# Altium schematic sheet Main.SchDoc
size A4; SheetNumber: 1; SheetTotal: 1
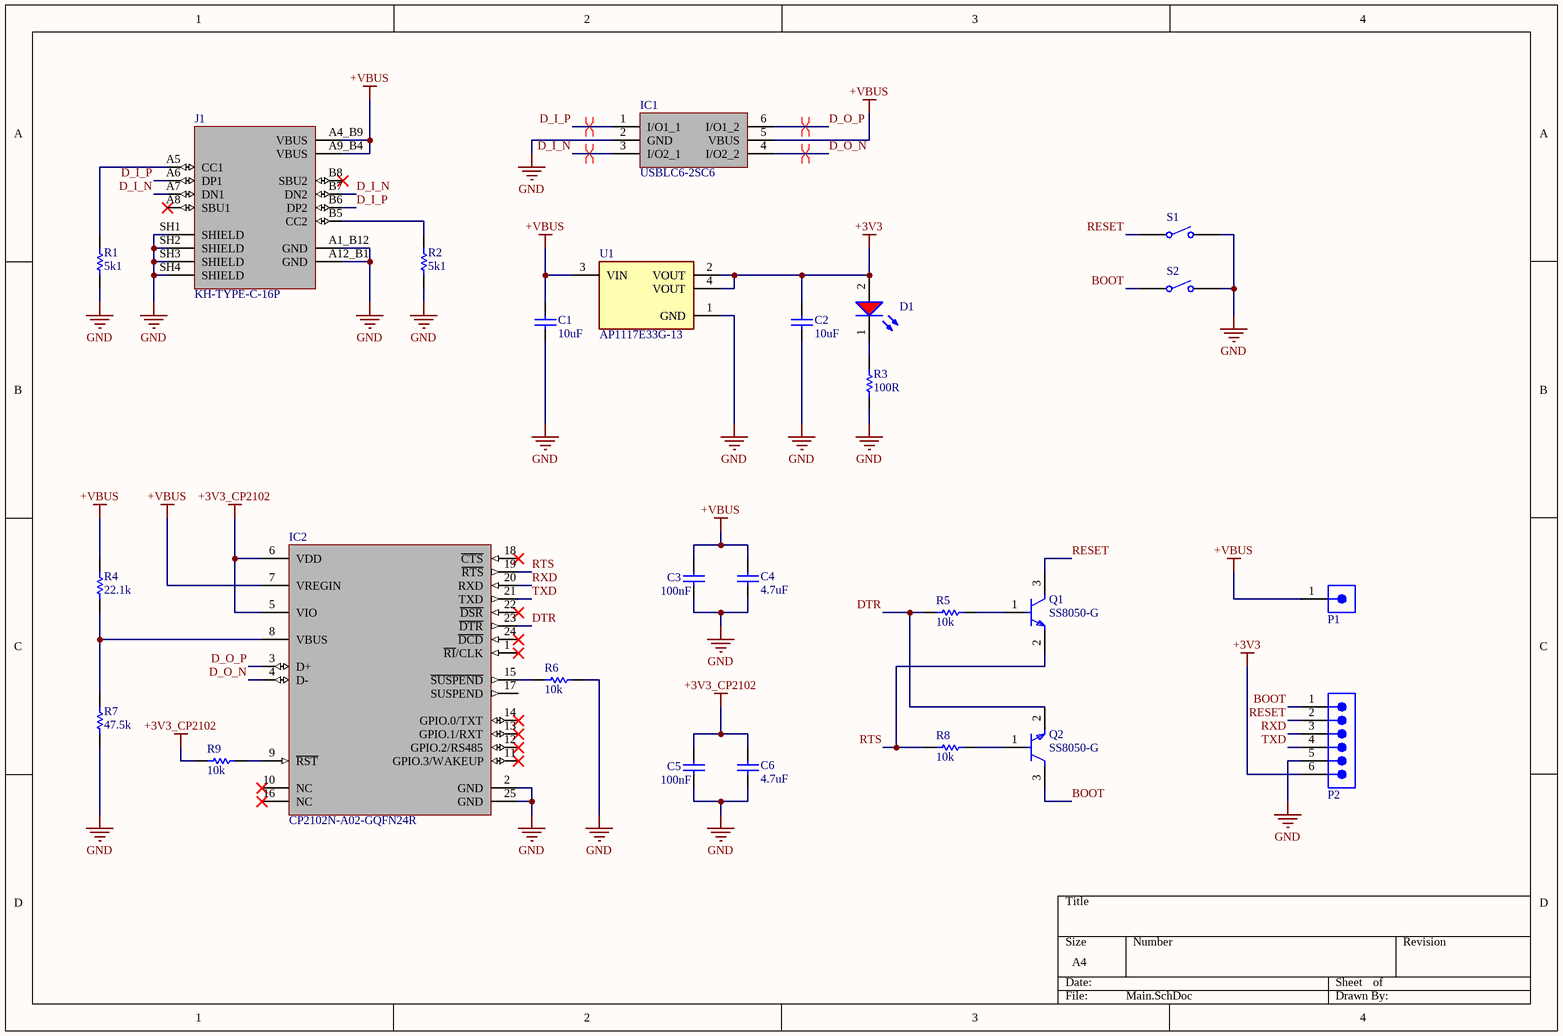
[diagram p0: Main.SchDoc]

## Parts
C1  value 10uF  [Wurth 0603 capacitor]  (hidden comment: Generic Capacitor 10uF 0603)
C2  value 10uF  [Wurth 0603 capacitor]  (hidden comment: Generic Capacitor 10uF 0603)
C3  value 100nF  [Wurth 0603 capacitor]  (hidden comment: Generic Capacitor 100nF 0603)
C4  value 4.7uF  [Wurth 0603 capacitor]  (hidden comment: Generic Capacitor 4.7uF 0603)
C5  value 100nF  [Wurth 0603 capacitor]  (hidden comment: Generic Capacitor 100nF 0603)
C6  value 4.7uF  [Wurth 0603 capacitor]  (hidden comment: Generic Capacitor 4.7uF 0603)
D1  150060RS75000  [WL-SMCW_0603_150060xx75000]  (value not drawn)
IC1  USBLC6-2SC6  [Tech Public SOT23-6]
IC2  CP2102N-A02-GQFN24R  [FP-CP2102N-A02-GQFN24R-IPC_C]
J1  KH-TYPE-C-16P  [KINGHELM_KH-TYPE-C-16P]
P1  61300111121  [1x1 2.54mm M]  (value not drawn)
P2  61300611121  [6x1 2.54mm M]  (value not drawn)
Q1  SS8050-G  [FP-SS8050-G-MFG]
Q2  SS8050-G  [FP-SS8050-G-MFG]
R1  value 5k1  [0805 Resistor]  (hidden comment: Generic Resistor 5k1 0805)
R2  value 5k1  [0805 Resistor]  (hidden comment: Generic Resistor 5k1 0805)
R3  value 100R  [Wurth 0603 Resistor]  (hidden comment: Generic Resistor 100R 0603)
R4  value 22.1k  [Wurth 0603 Resistor]  (hidden comment: Generic Resistor 22k1 0603)
R5  value 10k  [Wurth 0603 Resistor]  (hidden comment: Generic Resistor 10k 0603)
R6  value 10k  [Wurth 0603 Resistor]  (hidden comment: Generic Resistor 10k 0603)
R7  value 47.5k  [Wurth 0603 Resistor]  (hidden comment: Generic Resistor 47k5 0603)
R8  value 10k  [Wurth 0603 Resistor]  (hidden comment: Generic Resistor 10k 0603)
R9  value 10k  [Wurth 0603 Resistor]  (hidden comment: Generic Resistor 10k 0603)
S1  TS-1088R-02026  [TS1088R02026]  (value not drawn)
S2  TS-1088R-02026  [TS1088R02026]  (value not drawn)
U1  AP1117E33G-13  [FP-SOT223-MFG]

## Nets
+3V3: C2.2 D1.2(A) P2.6 U1.2(VOUT) U1.4(VOUT)
+3V3_CP2102: C5.2 C6.2 IC2.5(VIO) IC2.6(VDD) R9.1
+VBUS: C1.2 C3.2 C4.2 IC1.5(VBUS) IC2.7(VREGIN) J1.A4_B9(VBUS) J1.A9_B4(VBUS) P1.1 R4.2 U1.3(VIN)
GND: C1.1 C2.1 C3.1 C4.1 C5.1 C6.1 IC1.2(GND) IC2.2(GND) IC2.25(GND) J1.A1_B12(GND) J1.A12_B1(GND) J1.SH1(SHIELD) J1.SH2(SHIELD) J1.SH3(SHIELD) J1.SH4(SHIELD) P2.5 R1.1 R2.1 R3.1 R6.2 R7.1 S1.2 S2.2 U1.1(GND)
BOOT: P2.1 Q2.3(C) S2.1
D_I_N: IC1.3(I/O2_1) J1.A7(DN1) J1.B7(DN2)
D_I_P: IC1.1(I/O1_1) J1.A6(DP1) J1.B6(DP2)
D_O_N: IC1.4(I/O2_2) IC2.4(D-)
D_O_P: IC1.6(I/O1_2) IC2.3(D+)
DTR: IC2.23(~{DTR}) Q2.2(E) R5.1
RESET: P2.2 Q1.3(C) S1.1
RTS: IC2.19(~{RTS}) Q1.2(E) R8.1
RXD: IC2.20(RXD) P2.3
TXD: IC2.21(TXD) P2.4
NetD1_1: D1.1(K) R3.2
NetIC2_8: IC2.8(VBUS) R4.1 R7.2
NetIC2_9: IC2.9(~{RST}) R9.2
NetIC2_15: IC2.15(~{SUSPEND}) R6.1
NetJ1_A5: J1.A5(CC1) R1.2
NetJ1_B5: J1.B5(CC2) R2.2
NetQ1_1: Q1.1(B) R5.2
NetQ2_1: Q2.1(B) R8.2

Not connected (* = marked no-connect by the designer): IC2 1(~{RI}/CLK)* 10(NC)* 11(GPIO.3/WAKEUP)* 12(GPIO.2/RS485)* 13(GPIO.1/RXT)* 14(GPIO.0/TXT)* 16(NC)* 17(SUSPEND) 18(~{CTS})* 22(~{DSR})* 24(~{DCD})*; J1 A8(SBU1)* B8(SBU2)*

## Layout directives
differential pair; differential pair class USB_IN; net class USB: D_I_N, D_I_P
differential pair; differential pair class USB_OUT; net class USB: D_O_N, D_O_P

## Library data of the parts
D1 = CMP-1426-00001-3: NexarPartId: 29717776; Color: Red; Power Dissipation: 72mW; Max Reverse Voltage (DC): 5V; Peak Wavelength: 630nm; Viewing Angle: 140°; Forward Voltage: 2V; Luminous Intensity: 250mcd; Forward Current: 100mA; Dominant Wavelength: 625nm; Lens Style: Clear, Rectangular; Max Junction Temperature (Tj): 95°C; Test Current: 20mA; Mount: Surface Mount; Packaging: Tape and Reel; Case Code (Metric): 1608; Max Operating Temperature: 85°C; Case Code (Imperial): 0603; REACH SVHC: Unknown; Width: 800µm; Length: 1.6mm; Reverse Voltage: 5V; Height: 700µm; Case/Package: 0603; RoHS: Compliant; Wavelength: 625nm; Min Operating Temperature: -40°C
IC1 = Tech Public USBLC6-2SC6: Integrated Circuit; Height: 1.45mm; Manufacturer_Name: Tech Public; Manufacturer_Part_Number: USBLC6-2SC6; Mouser Part Number: 511-USBLC6-2SC6; Arrow Part Number: USBLC6-2SC6; Arrow Price/Stock: https://www.arrow.com/en/products/usblc6-2sc6/stmicroelectronics?region=nac
IC2 = Silicon Labs CP2102N-A02-GQFN24R: IC USB TO UART BRIDGE QFN24; Manufacturer Lifecycle Status: FULL PRODUCTION; NexarPartId: 99772192; Max Junction Temperature (Tj): 105°C; Min Supply Voltage: 1.71V; Max Supply Voltage: 3.6V; Number of Digital IO: 4; Interface: I2C, RS-485, UART, USB; Lifecycle Status: Production; Min Operating Temperature: -40°C; Height: 800µm; Ambient Temperature Range High: 85°C; Schedule B: 8542390000, 8542390000|8542390000|8542390000|8542390000|8542390000; Max Operating Temperature: 85°C; Supplier 1: Digikey; Supplier Part Number 1: 336-5888-1-ND; Supplier 2: Digikey; Supplier Part Number 2: 336-5888-6-ND; Supplier 3: Digikey; Supplier Part Number 3: 336-5888-2-ND; Supplier 4: Arrow Electronics; Supplier Part Number 4: CP2102N-A02-GQFN24R; Supplier 5: Farnell; Supplier Part Number 5: 3387002; Supplier 6: Farnell; Supplier Part Number 6: 3387002RL; Supplier 7: Mouser; Supplier Part Number 7: 634-CP2102NA02QFN24R; Supplier 8: Newark; Supplier Part Number 8: 66AH5403
J1 = KH-TYPE-C-16P: MF: kinghelm; Value: *; SnapEDA_Link: https://www.snapeda.com/parts/KH-TYPE-C-16P/Ki/view-part/?ref=snap; MP: KH-TYPE-C-16P; Check_prices: https://www.snapeda.com/parts/KH-TYPE-C-16P/Ki/view-part/?ref=eda; Availability: Not in stock; Price: None; Package: None
P1 = 1P: WR-PHD Pin Header, THT, Vertical, pitch 2.54mm, 1 Row, 1P; Manufacturer: Wurth Elektronik; Contact Resistance: 20mOhm; Rated Current: 3A; Working Voltage: 250V; Withstanding Voltage: 500V; Manufacturer Part Number: 61300111121; Category: Board-to-Board Connectors; Match Code: WR-PHD; ComponentLink1Description: Website Link; ComponentLink1URL: https://www.we-online.com/redexpert/article/61300111121?ad; ComponentLink2Description: Datasheet Link; ComponentLink2URL: https://www.we-online.com/redexpert/spec/61300111121?ad; Mount: Through Hole; Operating Temperature Max: 105°C; Operating Temperature Min: -40°C; Packaging: Bag; Gender: Pin Header; Number of Pins: 1; Number of Rows: 1; Orientation: Vertical; Pitch: 2.54mm
P2 = 6P: WR-PHD Pin Header, THT, Vertical, pitch 2.54mm, 1 Row, 6P; Manufacturer: Wurth Elektronik; Contact Resistance: 20mOhm; Rated Current: 3A; Working Voltage: 250V; Withstanding Voltage: 500V; Manufacturer Part Number: 61300611121; Category: Board-to-Board Connectors; Match Code: WR-PHD; ComponentLink1Description: Website Link; ComponentLink1URL: https://www.we-online.com/redexpert/article/61300611121?ad; ComponentLink2Description: Datasheet Link; ComponentLink2URL: https://www.we-online.com/redexpert/spec/61300611121?ad; Mount: Through Hole; Operating Temperature Max: 105°C; Operating Temperature Min: -40°C; Packaging: Bag; Gender: Pin Header; Number of Pins: 6; Number of Rows: 1; Orientation: Vertical; Pitch: 2.54mm
Q1 Q2 = CMP-20235-000001-1: NPN TRANSISTOR 1.5A 40V SOT-23 R; Transition Frequency: 100MHz; Max Breakdown Voltage: 25V; Collector Emitter Voltage (VCEO): 400mV; Max Power Dissipation: 300mW; Max Collector Current: 1.5A; Case/Package: TO-236-3; Packaging: Tape and Reel; RoHS Compliant: Yes; Mount: Surface Mount; Collector Emitter Breakdown Voltage: 25V
S1 S2 = XUNPU TS-1088R-02026
U1 = CMP-12756-000021-1: IC REG LINEAR 3.3V 1A SOT223-3; Manufacturer: Diodes; Obsolete Part: true; Max Supply Voltage: 18V; Output Type: Fixed; Number Of Outputs: 1; Min Supply Voltage: 6.4V; Dropout Voltage: 1.3V; Standoff Height: 0.01mm; Max Junction Temp: +125°C; Nominal Supply Current: 5mA; Octopart: https://octopart.com/ap1117e33g-13-diodes+inc.-669494; RoHS: TRUE; Package: SOT223; Lead Free: Yes; Output Current: 1A; Height: 1.8mm; Digikey Description: IC REG LINEAR 3.3V 1A SOT223-3; Device Class L3: Voltage Regulators - Linear; Device Class L1: Integrated Circuits (ICs); Temperature: -20°C to +125°C; Temperature Range Low: -20°C; Automotive: No; Ipc Land Pattern Name: SOT230P700X180-4; Footprint Url: https://www.diodes.com/assets/Package-Files/SOT223.pdf; ComponentLink2Description: Datasheet; Manufacturer Part Number: AP1117E33G-13; Mouser Description: LDO Voltage Regulators LDO BI 1.0A 1.3V 12V 5.0V 3.3V FIX; Temperature Range High: +125°C; Device Class L2: Power Management ICs; ComponentLink2URL: https://www.diodes.com/assets/Datasheets/AP1117.pdf; Output Voltage: 3.3V; Category: IC